# Altium schematic sheet Timing Unit.SchDoc
size A4; DocumentNumber: 4; SheetNumber: 4; SheetTotal: 7
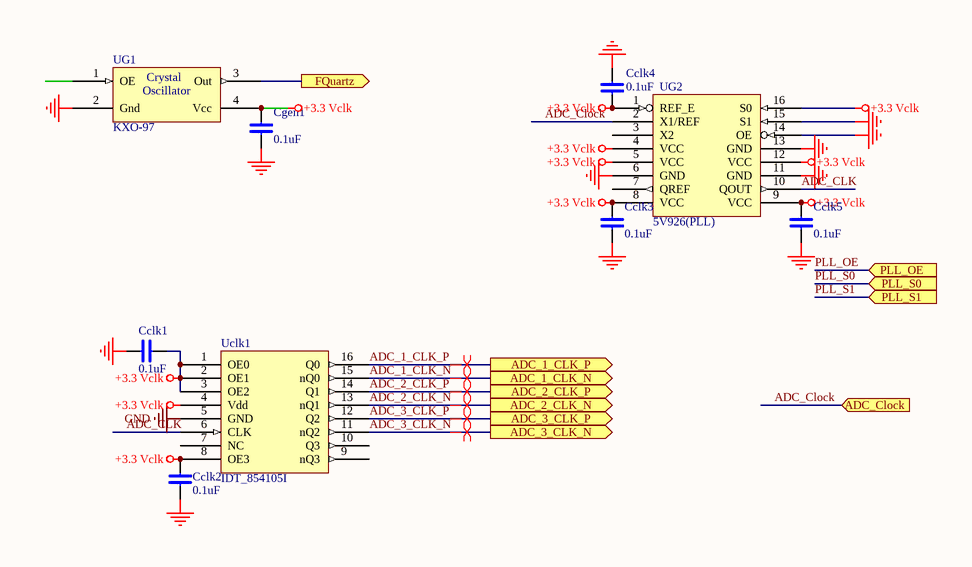
[diagram p0: Timing Unit.SchDoc]

## Parts
Cclk1  0.1uF  [chip0603]
Cclk2  0.1uF  [chip0603]
Cclk3  0.1uF  [chip0603]
Cclk4  0.1uF  [chip0603]
Cclk5  0.1uF  [chip0603]
Cgen1  0.1uF  [chip0603]
Uclk1  IDT_854105I  [TSSOP16]
UG1  KXO-97  [SG-636]
UG2  5V926(PLL)  [TSSOP16]

## Ports
ADC_1_CLK_N (out), ADC_1_CLK_P (out), ADC_2_CLK_N (out), ADC_2_CLK_P (out), ADC_3_CLK_N (out), ADC_3_CLK_P (out), ADC_Clock (in), FQuartz (out), PLL_OE (in), PLL_S0 (in), PLL_S1 (in)

## Nets
+3.3 Vclk: Cclk1.2 Cclk2.2 Cclk3.2 Cclk4.2 Cclk5.2 Cgen1.2 Uclk1.1(OE0) Uclk1.2(OE1) Uclk1.3(OE2) Uclk1.4(Vdd) Uclk1.8(OE3) UG1.4(Vcc) UG2.1(REF_E) UG2.4(VCC) UG2.5(VCC) UG2.8(VCC) UG2.9(VCC) UG2.12(VCC) UG2.16(S0)
GND: Cclk1.1 Cclk2.1 Cclk3.1 Cclk4.1 Cclk5.1 Cgen1.1 Uclk1.5(GND) UG1.2(Gnd) UG2.6(GND) UG2.11(GND) UG2.13(GND) UG2.14(OE) UG2.15(S1)
ADC_1_CLK_N: Uclk1.15(nQ0) ; port ADC_1_CLK_N
ADC_1_CLK_P: Uclk1.16(Q0) ; port ADC_1_CLK_P
ADC_2_CLK_N: Uclk1.13(nQ1) ; port ADC_2_CLK_N
ADC_2_CLK_P: Uclk1.14(Q1) ; port ADC_2_CLK_P
ADC_3_CLK_N: Uclk1.11(nQ2) ; port ADC_3_CLK_N
ADC_3_CLK_P: Uclk1.12(Q2) ; port ADC_3_CLK_P
ADC_CLK: Uclk1.6(CLK) UG2.10(QOUT)
ADC_Clock: UG2.2(X1/REF) ; port ADC_Clock
FQuartz: UG1.3(Out) ; port FQuartz
PLL_OE: port PLL_OE
PLL_S0: port PLL_S0
PLL_S1: port PLL_S1

Not connected (* = marked no-connect by the designer): Uclk1 7(NC) 9(nQ3) 10(Q3); UG1 1(OE); UG2 3(X2) 7(QREF)

## Layout directives
differential pair: ADC_1_CLK_N, ADC_1_CLK_P, ADC_2_CLK_N, ADC_2_CLK_P, ADC_3_CLK_N, ADC_3_CLK_P

## Notes on the sheet
- (in symbol SG-636) Crystal; Oscillator

## Library data of the parts
Cclk1-Cclk5 Cgen1 = C: Text Field1: 20; Text Field2: 10
UG1 = SG-636: Crystal Oscillator (SMD)